# EAGLE board Rev 1 (EAGLE 9.5.2)
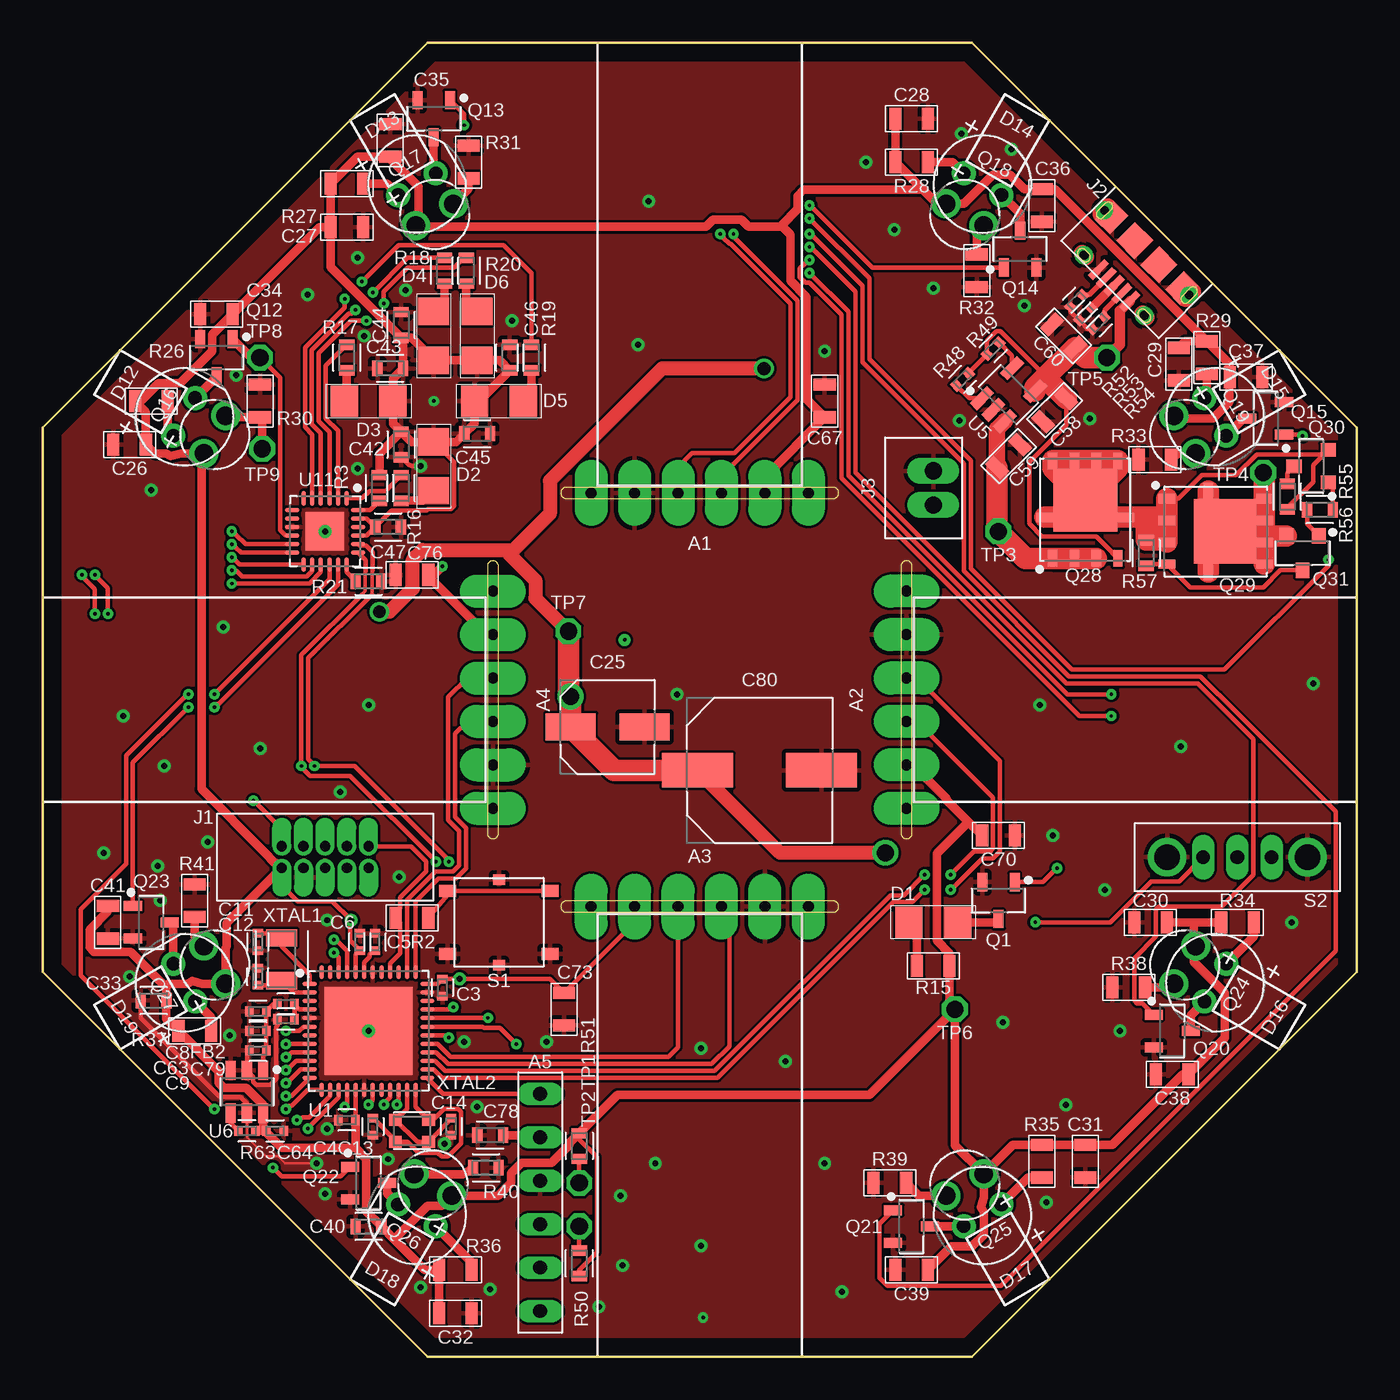
[diagram p8: board, top side]
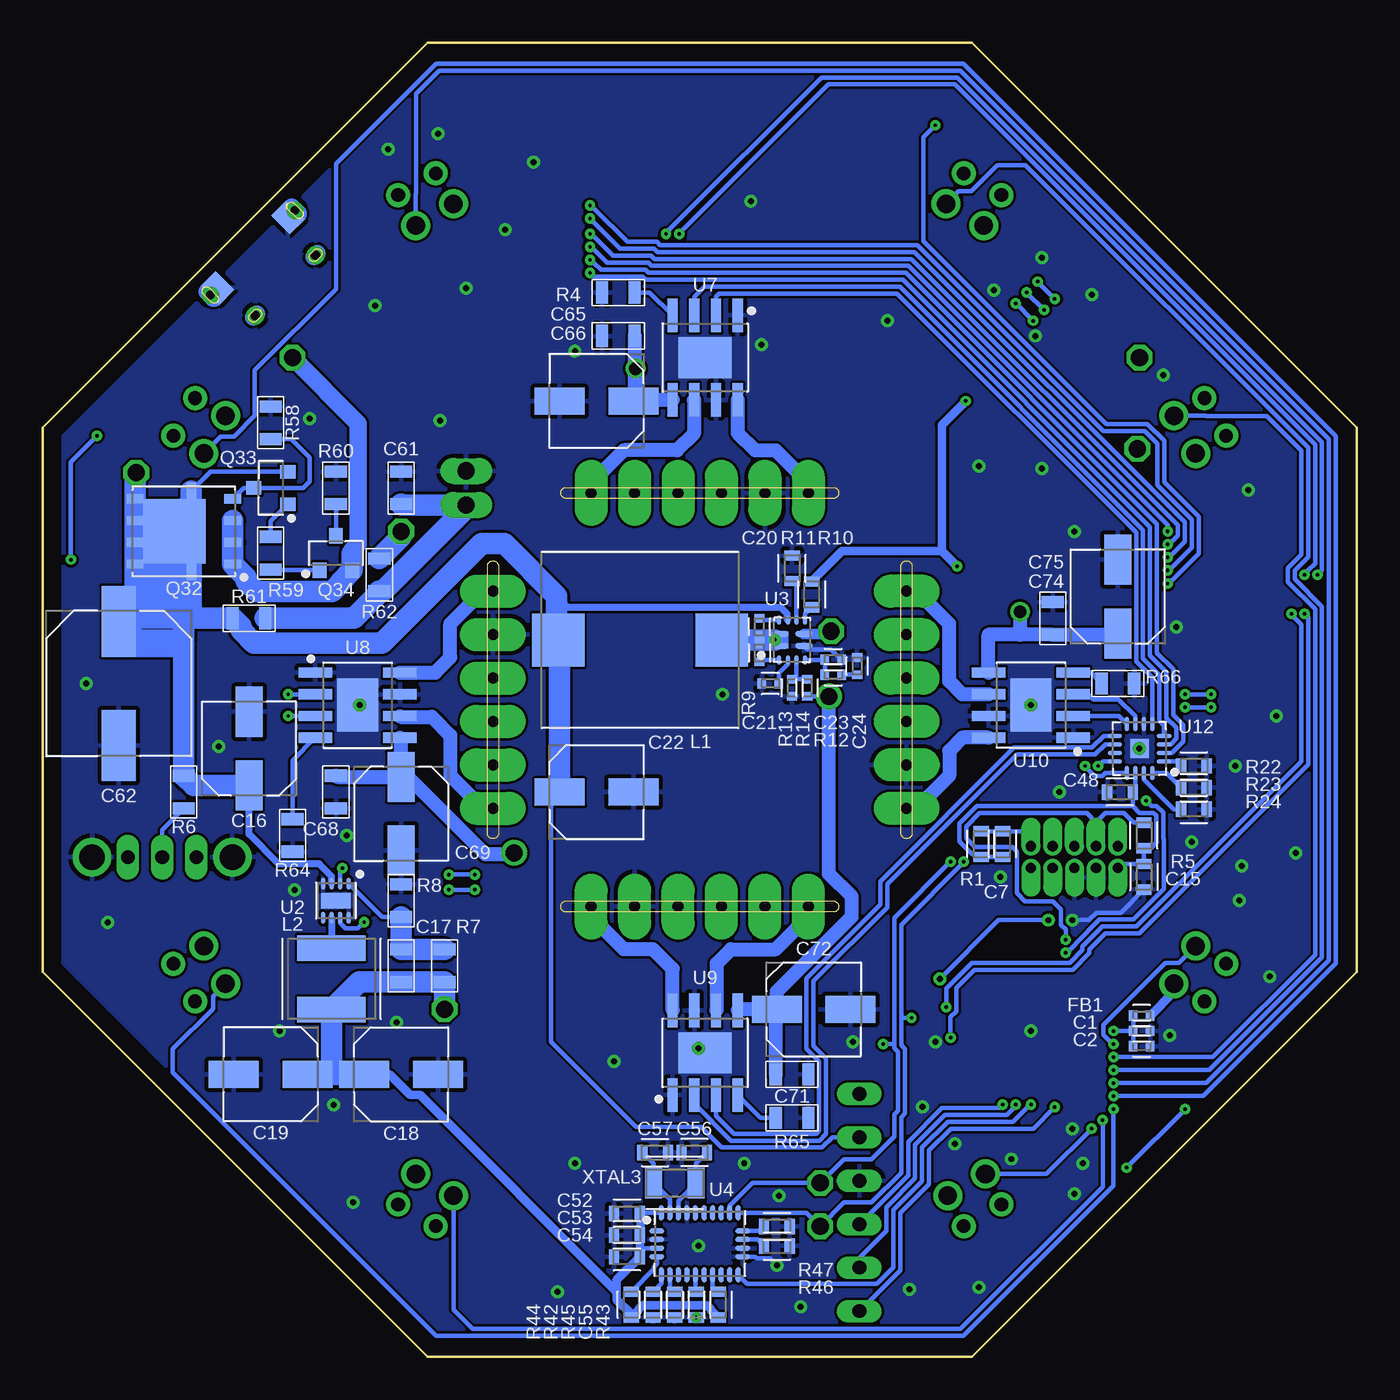
[diagram p9: board, bottom side, seen from below]

Size 76.83 x 76.83 mm. Coordinates in mm from the lower left corner, seen from the top.
Outline: 22.5,0 0,22.5 0,54.33 22.5,76.83 54.33,76.83 76.83,54.33 76.83,22.5 54.33,0 22.5,0
Copper layers (1*16): Top 0.035mm / dielectric 1.5mm / Bottom 0.035mm
Design rules "default *": minimum track width 6mil, minimum drill 0.2mm, track to track 6mil, track to pad 6mil, pad to pad 6mil, via to via 6mil, smd to smd 6mil, copper to edge 40mil, drill to drill 6mil, minimum pad ring 10mil, minimum via ring 8mil, stop-mask expansion 4mil, vias tented up to drill 0mil, thermal gap 10mil

## Footprints (pad centres in the part's own frame; a part is rotated, then mirrored left to right if it is on the bottom)
ENCODER-SLOT = drill 0.65 pad 1.93 long: 1 -6.35,0; 2 -3.81,0; 3 -1.27,0; 4 1.27,0; 5 3.81,0; 6 6.35,0
HC-05 = drill 0.8 long: 1 -6.35,0; 2 -3.81,0; 3 -1.27,0; 4 1.27,0; 5 3.81,0; 6 6.35,0
0402 = smd 0.5 x 0.6: 1 -0.5,0; 2 0.5,0
0603 = smd 0.6 x 0.9: 1 -0.75,0; 2 0.75,0
865080542006 = smd 2.925 x 1.579: + -2.155,0; - 2.155,0
0805 = smd 0.711 x 1.295: P$1 -0.953,0; P$2 0.953,0
EEE-1EA101AP = smd 4.162 x 1.999: + -3.625,0; - 3.625,0
1206 = smd 1.6 x 1.803: 1 -1.422,0; 2 1.422,0
SFH4545 = drill 0.8 pad 1.4: + -1.27,0; - 1.27,0
3220-10-0100-00 = drill 0.6 offset: P1 -0.635,2.54; P2 -0.635,1.27; P3 -0.635,0; P4 -0.635,-1.27; P5 -0.635,-2.54; P6 0.635,-2.54; P7 0.635,-1.27; P8 0.635,0; P9 0.635,1.27; P10 0.635,2.54
10118194-0001LF = smd 0.4 x 1.35: 1 -1.3,4.15; 2 -0.65,4.15; 3 0,4.15; 4 0.65,4.15; 5 1.3,4.15 | drill 0.5 pad 1: 6 -3.5,1.45; 7 3.5,1.45 | smd 1.2 x 1.55: 8 -2.9,1.45; 9 2.9,1.45 | smd 1.2 x 1.55 bottom: 10 -2.9,1.45; 11 2.9,1.45 | drill 0.55 pad 0.95: 12 2.5,4.15; 13 -2.5,4.15 | smd 1.5 x 1.55: 14 -1,1.45; 15 1,1.45
B2B-PH-K-S(LF)(SN) = drill 1 long: 1 -1,0; 2 1,0
104CDMCC = smd 3.062 x 3.11: 1 -4.775,0; 2 4.775,0
NRS5040 = smd 1.5 x 4: 1 -1.8,0; 2 1.8,0
SOT95P230X110-3 = smd 1.059 x 0.59: 1 -1.078,0.95; 2 -1.078,-0.95; 3 1.078,0
TEFT4300 = drill 1.09 pad 1.69: C -1.27,0; E 1.27,0
SI7157DP = smd 0.97 x 0.542: 1 -2.855,1.905; 2 -2.855,0.635; 3 -2.855,-0.635; 4 -2.855,-1.905; 5 2.855,-1.905; 6 2.855,-0.635; 7 2.855,0.635; 8 2.855,1.905 | smd 3.66 x 3.76: 9 0.54,0 | smd 0.542 x 0.97: 10 -0.44,2.365; 11 -0.44,-2.365
SOT96P237X112-3 = smd 0.9 x 0.8: 1 -1,0.95; 2 -1,-0.95; 3 1,0
PTS526SMG15SMTR2LFS = smd 1 x 0.7: 1 -3,1.85; 2 3,1.85; 3 -3,-1.85; 4 3,-1.85 | smd 0.7 x 0.6: 5 0,2.5; 6 0,-2.5
OS102011MS2QN1 = drill 0.8 long: 1 -2,0; 2 0,0; 3 2,0 | drill 1.5: 4 -4.1,0; 5 4.1,0
TESTPOINT = drill 1 octagon: P1 0,0
ATSAMD21G18A-MU = smd 0.837 x 0.264: 1 -3.437,2.75; 2 -3.437,2.25; 3 -3.437,1.75; 4 -3.437,1.25; 5 -3.437,0.75; 6 -3.437,0.25; 7 -3.437,-0.25; 8 -3.437,-0.75; 9 -3.437,-1.25; 10 -3.437,-1.75; 11 -3.437,-2.25; 12 -3.437,-2.75; 25 3.437,-2.75; 26 3.437,-2.25; 27 3.437,-1.75; 28 3.437,-1.25; 29 3.437,-0.75; 30 3.437,-0.25; 31 3.437,0.25; 32 3.437,0.75; 33 3.437,1.25; 34 3.437,1.75; 35 3.437,2.25; 36 3.437,2.75 | smd 0.264 x 0.837: 13 -2.75,-3.437; 14 -2.25,-3.437; 15 -1.75,-3.437; 16 -1.25,-3.437; 17 -0.75,-3.437; 18 -0.25,-3.437; 19 0.25,-3.437; 20 0.75,-3.437; 21 1.25,-3.437; 22 1.75,-3.437; 23 2.25,-3.437; 24 2.75,-3.437; 37 2.75,3.437; 38 2.25,3.437; 39 1.75,3.437; 40 1.25,3.437; 41 0.75,3.437; 42 0.25,3.437; 43 -0.25,3.437; 44 -0.75,3.437; 45 -1.25,3.437; 46 -1.75,3.437; 47 -2.25,3.437; 48 -2.75,3.437 | smd 5.15 x 5.15: 49 0,0
AP3441 = smd 0.715 x 0.27: 1 -1.001,0.75; 2 -1.001,0.25; 3 -1.001,-0.25; 4 -1.001,-0.75; 5 1.001,-0.75; 6 1.001,-0.25; 7 1.001,0.25; 8 1.001,0.75 | smd 0.9 x 1.7: 9 0,0
TPS61089 = smd 0.25 x 0.55: 1 -0.75,-1.175; 2 -0.25,-1.175; 3 0.25,-1.175; 4 0.75,-1.175; 7 0.75,1.175; 8 0.25,1.175; 9 -0.25,1.175; 10 -0.75,1.175 | smd 1 x 0.35: 5 0.7,-0.35; 6 0.7,0.35; 11 -0.7,0.35; 12 -0.7,-0.35 | drill 0.2 pad 0.45: 13 -1,0
BNO055 = smd 0.887 x 0.282: 1 -2.513,0.75; 2 -2.513,0.25; 3 -2.513,-0.25; 4 -2.513,-0.75; 15 2.513,-0.75; 16 2.513,-0.25; 17 2.513,0.25; 18 2.513,0.75 | smd 0.282 x 0.887: 5 -2.25,-1.812; 6 -1.75,-1.812; 7 -1.25,-1.812; 8 -0.75,-1.812; 9 -0.25,-1.812; 10 0.25,-1.812; 11 0.75,-1.812; 12 1.25,-1.812; 13 1.75,-1.812; 14 2.25,-1.812; 19 2.25,1.812; 20 1.75,1.812; 21 1.25,1.812; 22 0.75,1.812; 23 0.25,1.812; 24 -0.25,1.812; 25 -0.75,1.812; 26 -1.25,1.812; 27 -1.75,1.812; 28 -2.25,1.812
MCP73811 = smd 1.412 x 0.59: 1 -1.247,0.95; 2 -1.247,0; 3 -1.247,-0.95; 4 1.247,-0.95; 5 1.247,0.95
MCP1501 = smd 1.119 x 0.59: 1 -1.246,0.95; 2 -1.246,0; 3 -1.246,-0.95; 4 1.246,-0.95; 5 1.246,0; 6 1.246,0.95
DRV8871 = smd 1.968 x 0.599: 1 -2.473,1.905; 2 -2.473,0.635; 3 -2.473,-0.635; 4 -2.473,-1.905; 5 2.473,-1.905; 6 2.473,-0.635; 7 2.473,0.635; 8 2.473,1.905 | smd 2.4 x 3.1: 9 0,0
PCAL6416A = smd 0.86 x 0.264: 1 -1.935,1.25; 2 -1.935,0.75; 3 -1.935,0.25; 4 -1.935,-0.25; 5 -1.935,-0.75; 6 -1.935,-1.25; 13 1.935,-1.25; 14 1.935,-0.75; 15 1.935,-0.25; 16 1.935,0.25; 17 1.935,0.75; 18 1.935,1.25 | smd 0.264 x 0.86: 7 -1.25,-1.935; 8 -0.75,-1.935; 9 -0.25,-1.935; 10 0.25,-1.935; 11 0.75,-1.935; 12 1.25,-1.935; 19 1.25,1.935; 20 0.75,1.935; 21 0.25,1.935; 22 -0.25,1.935; 23 -0.75,1.935; 24 -1.25,1.935 | smd 2.25 x 2.25: 25 0,0
MAX7315 = smd 0.86 x 0.27: 1 -1.435,0.75; 2 -1.435,0.25; 3 -1.435,-0.25; 4 -1.435,-0.75; 9 1.435,-0.75; 10 1.435,-0.25; 11 1.435,0.25; 12 1.435,0.75 | smd 0.27 x 0.86: 5 -0.75,-1.435; 6 -0.25,-1.435; 7 0.25,-1.435; 8 0.75,-1.435; 13 0.75,1.435; 14 0.25,1.435; 15 -0.25,1.435; 16 -0.75,1.435 | smd 1.1 x 1.1: 17 0,0
FC-135 = smd 1 x 1.8: 1 -1.25,0; 2 1.25,0
XRCGB = smd 0.75 x 0.7: 1 0.975,0.65; 2 -0.975,0.65; 3 -0.975,-0.65; 4 0.975,-0.65

## Placement (x,y rotation side)
A1  ENCODERSLOT  [ENCODER-SLOT]  38.41,50.51 180 top
A2  ENCODERSLOT  [ENCODER-SLOT]  50.51,38.41 90 top
A3  ENCODERSLOT  [ENCODER-SLOT]  38.41,26.32 0 top
A4  ENCODERSLOT  [ENCODER-SLOT]  26.32,38.41 270 top
A5  HC-05  [HC-05]  29.08,9.02 90 top
C1  10uF  [0402]  12.57,19.05 180 bottom
C2  0.1uF  [0402]  12.57,18.16 180 bottom
C3  0.1uF  [0402]  23.37,21.59 90 top
C4  0.1uF  [0402]  17.78,13.84 0 top
C5  1uF  [0402]  19.43,24.26 270 top
C6  10uF  [0402]  18.54,24.26 270 top
C7  100pF  [0603]  20.7,29.97 270 bottom
C8  0.1uF  [0402]  12.57,20.19 0 top
C9  4.7uF  [0402]  12.57,17.91 0 top
C11  22pF  [0402]  12.57,24.26 90 top
C12  22pF  [0402]  12.57,22.23 270 top
C13  6.8pF  [0402]  19.3,13.46 90 top
C14  10pF  [0402]  23.88,13.46 90 top
C15  0.1uF  [0603]  12.45,28.07 90 bottom
C16  22uF  [865080542006]  64.77,35.56 90 bottom
C17  22pF  [0805]  55.88,22.86 270 bottom
C18  22uF  [865080542006]  55.88,16.51 0 bottom
C19  22uF  [865080542006]  63.5,16.51 180 bottom
C20  0.1uF  [0402]  34.92,42.67 270 bottom
C21  2.2uF  [0402]  34.29,39.37 0 bottom
C22  22uF  [865080542006]  44.45,33.02 0 bottom
C23  33pF  [0402]  30.61,40.77 180 bottom
C24  680pF  [0402]  29.21,40.39 270 bottom
C25  22uF  [865080542006]  33.02,36.83 0 top
C26  1uF  [0805]  5.08,53.34 0 top
C27  1uF  [0805]  17.78,66.04 180 top
C28  1uF  [0805]  50.8,72.39 180 top
C29  1uF  [0805]  66.42,58.04 90 top
C30  1uF  [0805]  64.77,25.4 0 top
C31  1uF  [0805]  60.96,11.43 90 top
C32  1uF  [0805]  24.13,2.54 180 top
C33  1uF  [0603]  6.48,20.83 0 top
C34  0.1uF  [0805]  10.16,60.96 0 top
C35  0.1uF  [0805]  20.32,71.12 270 top
C36  0.1uF  [0805]  58.42,67.31 90 top
C37  0.1uF  [0805]  70.36,57.28 180 top
C38  0.1uF  [0805]  66.04,16.51 0 top
C39  0.1uF  [0805]  50.8,5.08 0 top
C40  0.1uF  [0603]  19.05,7.62 0 top
C41  0.1uF  [0805]  3.81,25.4 90 top
C42  1uF  [0603]  20.95,53.34 90 top
C43  1uF  [0603]  20.32,57.78 0 top
C44  1uF  [0603]  20.95,60.33 270 top
C45  1uF  [0603]  25.4,53.98 180 top
C46  1uF  [0603]  27.3,58.42 270 top
C47  0.1uF  [0603]  20.19,48.51 180 top
C48  0.1uF  [0603]  13.84,33.02 0 bottom
C52  0.1uF  [0603]  42.67,8.38 0 bottom
C53  0.12uF  [0603]  42.67,7.11 0 bottom
C54  6800pF  [0603]  42.67,5.84 0 bottom
C55  0.1uF  [0603]  38.61,3.05 90 bottom
C56  22pF  [0603]  38.73,11.94 0 bottom
C57  22pF  [0603]  41.02,11.94 180 bottom
C58  1uF  [0805]  59.16,55.35 45 top
C59  1uF  [0805]  56.47,52.66 225 top
C60  1uF  [0805]  59.69,59.69 315 top
C61  10uF  [0805]  55.88,50.8 270 bottom
C62  100uF  [EEE-1EA101AP]  72.39,39.37 270 bottom
C63  300pF  [0402]  12.57,19.05 0 top
C64  2.2uF  [0402]  13.59,13.21 180 top
C65  0.1uF  [0805]  43.18,59.69 0 bottom
C66  22uF  [865080542006]  44.45,55.88 180 bottom
C67  1uF  [0805]  45.72,55.88 270 top
C68  0.1uF  [0805]  59.69,33.02 90 bottom
C69  22uF  [865080542006]  55.88,31.75 270 bottom
C70  1uF  [0805]  55.88,30.48 180 top
C71  0.1uF  [0805]  33.02,16.51 180 bottom
C72  22uF  [865080542006]  31.75,20.32 0 bottom
C73  1uF  [0805]  30.48,20.32 90 top
C74  0.1uF  [0805]  17.78,43.18 270 bottom
C75  22uF  [865080542006]  13.97,44.45 90 bottom
C76  1uF  [0805]  21.59,45.72 0 top
C78  1uF  [0603]  26.16,12.95 0 top
C79  0.1uF  [0402]  14.22,19.74 0 top
C80  100uF  [EEE-1EA101AP]  41.91,34.29 0 top
D1  LED1206  [1206]  52.07,25.4 0 top
D2  LED1206  [1206]  22.86,52.07 270 top
D3  LED1206  [1206]  19.05,55.88 180 top
D4  LED1206  [1206]  22.86,59.69 90 top
D5  LED1206  [1206]  26.67,55.88 0 top
D6  LED1206  [1206]  25.4,59.69 90 top
D12  SFH4545  [SFH4545]  8.27,54.95 60 top
D13  SFH4545  [SFH4545]  21.88,68.56 30 top
D14  SFH4545  [SFH4545]  54.95,68.56 330 top
D15  SFH4545  [SFH4545]  68.56,54.95 300 top
D16  SFH4545  [SFH4545]  68.56,21.88 240 top
D17  SFH4545  [SFH4545]  54.95,8.27 210 top
D18  SFH4545  [SFH4545]  21.88,8.27 150 top
D19  SFH4545  [SFH4545]  8.27,21.88 120 top
FB1  [0402]  12.57,19.94 0 bottom
FB2  [0402]  14.22,20.62 0 top
J1  3220-10-0100-00  [3220-10-0100-00]  16.51,29.21 90 top
J2  10118194-0001LF  [10118194-0001LF]  65.58,65.58 135 top
J3  B2B-PH-K-S(LF)(SN)  [B2B-PH-K-S(LF)(SN)]  52.07,50.8 90 top
L1  10uH  [104CDMCC]  41.91,41.91 180 bottom
L2  3.3uH  [NRS5040]  59.94,22.1 270 bottom
Q1  MMBT3904,215MMBT3904,215  [SOT95P230X110-3]  55.88,26.67 270 top
Q12  MMBT3904,215MMBT3904,215  [SOT95P230X110-3]  10.16,58.42 270 top
Q13  MMBT3904,215MMBT3904,215  [SOT95P230X110-3]  22.86,72.39 270 top
Q14  MMBT3904,215MMBT3904,215  [SOT95P230X110-3]  57.15,64.77 90 top
Q15  MMBT3904,215MMBT3904,215  [SOT95P230X110-3]  71.5,54.86 180 top
Q16  TEFT4300  [TEFT4300]  10.05,53.92 60 top
Q17  TEFT4300  [TEFT4300]  22.91,66.78 30 top
Q18  TEFT4300  [TEFT4300]  53.92,66.78 330 top
Q19  TEFT4300  [TEFT4300]  66.78,53.92 300 top
Q20  MMBT3904,215MMBT3904,215  [SOT95P230X110-3]  66.04,19.05 0 top
Q21  MMBT3904,215MMBT3904,215  [SOT95P230X110-3]  50.8,7.62 0 top
Q22  MMBT3904,215MMBT3904,215  [SOT95P230X110-3]  19.05,10.16 0 top
Q23  MMBT3904,215MMBT3904,215  [SOT95P230X110-3]  6.35,25.4 0 top
Q24  TEFT4300  [TEFT4300]  66.78,22.91 240 top
Q25  TEFT4300  [TEFT4300]  53.92,10.05 210 top
Q26  TEFT4300  [TEFT4300]  22.81,10.05 150 top
Q27  TEFT4300  [TEFT4300]  10.05,22.91 120 top
Q28  SI7157DP  [SI7157DP]  60.96,49.53 90 top
Q29  SI7157DP  [SI7157DP]  68.58,48.26 0 top
Q30  MMBT3906  [SOT96P237X112-3]  74.17,52.07 180 top
Q31  MMBT3906  [SOT96P237X112-3]  73.66,46.99 270 top
Q32  SI7157DP  [SI7157DP]  68.58,48.26 180 bottom
Q33  MMBT3906  [SOT96P237X112-3]  63.5,50.8 180 bottom
Q34  MMBT3906  [SOT96P237X112-3]  59.69,46.99 90 bottom
R1  2.2k  [0603]  21.97,29.97 270 bottom
R2  330R  [0805]  21.59,25.65 180 top
R3  10k  [0603]  19.68,50.8 90 top
R4  30k  [0805]  43.18,62.23 0 bottom
R5  1k  [0603]  12.45,30.48 270 bottom
R6  10k  [0805]  68.58,33.02 90 bottom
R7  68k  [0805]  53.34,22.86 270 bottom
R8  15k  [0805]  55.88,26.67 270 bottom
R9  270k  [0402]  34.92,41.15 90 bottom
R10  10k  [0603]  31.88,44.58 90 bottom
R11  150k  [0603]  33.02,46.1 270 bottom
R12  348k  [0402]  30.61,39.88 180 bottom
R13  18k  [0402]  33.02,39.12 90 bottom
R14  160k  [0402]  32.13,39.12 270 bottom
R15  30R  [0805]  52.07,22.86 0 top
R16  30R  [0603]  20.95,50.8 270 top
R17  30R  [0603]  17.78,58.42 270 top
R18  30R  [0603]  23.5,63.5 270 top
R19  30R  [0603]  28.57,58.42 270 top
R20  30R  [0603]  24.77,63.5 270 top
R21  10k  [0603]  19.05,45.34 180 top
R22  10k  [0603]  9.53,34.54 180 bottom
R23  10k  [0603]  9.53,33.27 180 bottom
R24  10k  [0603]  9.53,32 180 bottom
R26  17R  [0805]  6.35,55.88 0 top
R27  17R  [0805]  17.78,68.58 0 top
R28  17R  [0805]  50.8,69.85 0 top
R29  17R  [0805]  68.07,58.42 270 top
R30  1k  [0805]  12.7,55.88 270 top
R31  1k  [0805]  24.89,69.85 270 top
R32  1k  [0805]  54.61,63.5 90 top
R33  1k  [0805]  65.02,52.45 0 top
R34  17R  [0805]  69.85,25.4 0 top
R35  17R  [0805]  58.42,11.43 270 top
R36  17R  [0805]  24.13,5.08 0 top
R37  17R  [0805]  8.89,19.05 0 top
R38  1k  [0805]  63.5,21.59 0 top
R39  1k  [0805]  49.53,10.16 0 top
R40  1k  [0603]  25.91,11.05 180 top
R41  1k  [0805]  8.89,26.67 270 top
R42  10k  [0603]  41.15,3.05 90 bottom
R43  10k  [0603]  37.34,3.05 270 bottom
R44  10k  [0603]  42.42,3.05 270 bottom
R45  10k  [0603]  39.88,3.05 90 bottom
R46  10k  [0603]  33.91,6.48 180 bottom
R47  10k  [0603]  33.91,7.62 180 bottom
R48  10k  [0402]  53.78,57.15 45 top
R49  10k  [0402]  55.57,58.95 225 top
R50  4.7k  [0603]  31.37,5.46 270 top
R51  4.7k  [0603]  31.37,12.32 90 top
R52  10k  [0402]  60.45,61.72 45 top
R53  100k  [0402]  60.96,60.96 45 top
R54  100k  [0402]  61.72,60.45 45 top
R55  68k  [0603]  72.77,50.29 270 top
R56  10k  [0603]  74.68,49.53 0 top
R57  100k  [0603]  64.52,46.99 90 top
R58  100k  [0805]  63.5,54.61 270 bottom
R59  10k  [0805]  63.5,46.99 90 bottom
R60  68k  [0805]  59.69,50.8 270 bottom
R61  0R  [0805]  64.77,43.18 0 bottom
R62  0R  [0805]  57.15,45.72 270 bottom
R63  10k  [0402]  11.94,13.21 0 top
R64  30k  [0805]  62.23,30.48 90 bottom
R65  30k  [0805]  33.02,13.97 180 bottom
R66  30k  [0805]  13.97,39.37 180 bottom
S1  PTS526SMG15SMTR2LFS  [PTS526SMG15SMTR2LFS]  26.67,25.4 180 top
S2  OS102011MS2QN1  [OS102011MS2QN1]  69.85,29.21 180 top
TP1  TESTPOINT  [TESTPOINT]  31.37,10.16 270 top
TP2  TESTPOINT  [TESTPOINT]  31.37,7.62 270 top
TP3  TESTPOINT  [TESTPOINT]  55.88,48.26 0 top
TP4  TESTPOINT  [TESTPOINT]  71.37,51.69 0 top
TP5  TESTPOINT  [TESTPOINT]  62.23,58.42 0 top
TP6  TESTPOINT  [TESTPOINT]  53.34,20.32 0 top
TP7  TESTPOINT  [TESTPOINT]  30.73,42.42 0 top
TP8  TESTPOINT  [TESTPOINT]  12.7,58.42 0 top
TP9  TESTPOINT  [TESTPOINT]  12.83,53.09 0 top
U1  ATSAMD21G18A-MU  [ATSAMD21G18A-MU]  19.05,19.05 0 top
U2  AP3441  [AP3441]  59.69,26.67 270 bottom
U3  TPS61089  [TPS61089]  33.02,41.91 0 bottom
U4  BNO055  [BNO055]  38.41,6.6 0 bottom
U5  MCP73811  [MCP73811]  56.47,56.25 45 top
U6  [MCP1501]  11.94,15.49 270 top
U7  DRV8871  [DRV8871]  38.1,58.42 270 bottom
U8  DRV8871  [DRV8871]  58.42,38.1 0 bottom
U9  DRV8871  [DRV8871]  38.1,17.78 90 bottom
U10  DRV8871  [DRV8871]  19.05,38.1 180 bottom
U11  PCAL6416A  [PCAL6416A]  16.51,48.26 270 top
U12  MAX7315  [MAX7315]  12.7,35.56 180 bottom
XTAL1  32.768kHz  [FC-135]  13.97,23.24 270 top
XTAL2  32MHz  [XRCGB]  21.59,13.21 0 top
XTAL3  32.768kHz  [FC-135]  39.88,10.16 180 bottom

## Tracks (layer width: path | path; a pad name or v marks a point on that pad's centre or on a via)
!RESET
  Top 0.254: U1.40 20.3,22.99 20.89,23.58 20.89,25.4 R2.P$2 20.64,25.97 20.89,26.23 20.89,26.87 22.4,28.38 22.4,28.96 21.52,29.84 J1.P6
  Bottom 0.254: R1.1 C7.1 19.19,30.72 19.18,30.73 19.05,30.61 J1.P6
+3V3  (via drill 0.2, 0.35)
  Top 0.254: U1.36 23.08,21.8 C3.2 v24.38,22.1 29.65,22.1 C73.P$2 34.6,25.4 A3.2 | 12.89,13.97 12.89,13.41 C64.2 | R51.2 31.37,12.71 32.4,11.68 32.4,6.1 31.37,5.07 R50.2 | C4.2 18.28,15.59 U1.17 | U1.44 18.3,23.52 C6.2 17.96,24.34 17.96,25.46 v18.03,25.53 16.93,26.63 14.89,26.63 13.97,27.56 J1.P1 | U11.23 18.95,49.01 C47.2 | U11.21 18.94,48.01 C47.2 | C47.2 20.4,49.47 22.44,49.47 22.54,49.57 23.88,49.57 24.04,49.73 24.04,52.31 D2.1
  Top 0.508: A4.2 25.95,42.23 22.54,45.64 C76.P$2 22.86,45.72 v23.37,46.23 | A1.2 42.23,51.43 C67.P$2 44.67,55.98 44.67,61.96 43.72,62.91 43.72,65.61 43.25,66.07 | C70.P$2 54.13,31.27 | 54.13,31.27 52.85,32.56 52.85,32.63 50.88,34.6 A2.2 | TP6.P1 53.02,20.64 R15.P$2 53.02,23.59 52.29,24.33 52.29,29.43 54.13,31.27 | Q25.C 56.72,12.38 R35.P$1 C31.P$2 62.54,12.38 66.67,16.51 C38.P$2 69.11,18.63 69.11,21.27 67.31,23.07 67.31,24.11 | Q25.C 55.02,9.34 54.86,8.75 55.02,8.48 55.02,7.96 55.04,7.95 55.04,7.14 54.34,6.45 53.12,6.45 C39.P$2 | R34.P$1 67.31,25.4 | 67.31,25.4 C30.P$2 | Q24.C 67.31,24.11 | 67.31,24.11 67.31,25.4 | C29.P$2 66.8,59.37 R29.P$1 | R29.P$1 69.41,58.04 C37.P$2 69.38,57.25 69.38,55.83 68.42,54.86 66.3,54.86 Q19.C | 51.47,68.23 52.28,67.42 Q18.C 53.86,67.42 55.56,69.11 56.54,69.11 57.39,68.26 C36.P$2 59.18,68.26 66.31,61.12 66.32,61.12 R29.P$1 | 51.47,68.23 R28.P$1 C28.P$2 | C27.P$2 R27.P$1 18.41,70.17 C35.P$2 20.32,70.06 21.97,68.42 21.97,66.3 Q17.C 21.88,66.07 38.78,66.07 39.2,66.5 40.85,66.5 41.27,66.07 43.25,66.07 | C27.P$2 16.19,66.04 C34.P$2 9.91,59.76 9.91,58.8 8.04,56.93 6.78,56.93 5.72,55.88 R26.P$1 6.03,55.24 C26.P$2 6.55,52.82 7.21,52.82 7.48,52.66 8.07,52.82 Q16.C 9.29,52.69 9.29,33.19 13.01,29.46 13.01,29.45 13.57,28.89 13.66,28.89 J1.P1 10.76,25.36 10.76,23.99 10.69,23.91 Q27.C 9.34,21.81 8.75,21.97 8.48,21.81 8.45,21.79 7.31,21.79 7.23,21.71 7.23,21.59 | 7.23,21.59 C33.2 7.23,19.76 R37.P$1 10.29,16.7 10.29,16.01 10.58,15.72 11.89,15.72 12.89,14.73 U6.6 12.89,13.97 12.89,13.4 12.7,13.21 | C32.P$2 R36.P$1 22.34,5.08 20.7,6.72 20.54,6.88
  Top 0.508: 20.54,6.88 C40.2 18.91,8.51 18.91,11.57 18.28,12.2 | 20.54,6.88 22.49,8.82 23.32,8.82 Q26.C 26.62,9.41 27.37,10.16 27.37,10.73 27.99,11.35 29.76,11.35 30.8,12.39 30.8,12.5 R51.2 33.6,15.3 48.32,15.3 TP6.P1 | Q25.C 53.34,12.37 TP6.P1 | 18.28,12.2 C4.2 | 18.28,12.2 13.97,12.2 13.09,13.08 C64.2 12.7,13.21 | 12.7,13.21 R63.2 | C42.2 21.55,53.49 D2.1 24.17,53.49 C45.2 25.25,54.57 D5.1 25.52,55.88 C46.2 26.71,58.27 D6.1 D4.1 21.55,59.58 C44.2 | C42.2 20.47,54.57 D3.1 20.47,57.19 C43.2 21.07,59.46 C44.2 | C44.2 16.83,63.7 C27.P$2 | C41.P$2 3.81,26.03 2.76,24.97 2.76,23.92 2.99,23.69 5.13,23.69 7.23,21.59 | 51.47,68.23 44.48,68.23 44.12,67.87 44.12,67.09 43.18,66.14 43.25,66.07 | R3.2 19.68,52.82 C42.2
  Bottom 0.254: J1.P1 13.73,28.82 C15.2 R5.2 12.05,29.73 11.68,30.1 11.72,30.13 11.72,31.65 11.88,31.81 12.7,31.81 13.08,32.19 | U4.28 41.89,8.42 | U4.3 41.92,6.35 | 13.08,32.19 22.22,32.19 23.23,31.18 23.23,30.14 22.49,29.39 22.14,29.39 R1.2 C7.2 | U12.14 12.95,33.16 C48.2 13.09,32.2 13.08,32.19 | v18.03,25.53 20.95,25.53 v24.38,22.1
  Bottom 0.508: C52.2 41.89,8.42 41.89,7.15 C53.2 41.92,6.35 C54.2 43.27,4.49 43.27,3.81 | 43.27,3.81 43.27,3.33 42.42,2.47 R44.2 42,2.71 42,2.77 41.77,3 37.99,3 37.75,2.77 37.75,2.71 R43.2 | 43.27,3.81 54.78,15.31 55.36,15.31 56.55,16.51 C18.+ | FB1.2 10.69,21.33 Q27.C | v23.37,46.23 24.26,47.12 | R10.2 30.09,47.12 24.26,47.12 | v22.86,55.88 24.26,54.48 24.26,47.12
  Bottom 1.27: C18.+ 59.69,16.51 | 59.69,16.51 C19.+ | 59.69,16.51 59.94,16.76 L2.2 58.33,21.91 C17.P$2 R7.P$2 TP6.P1
  pour Top: 20.95,59.69 20.95,57.78 20.32,57.15 20.32,54.61 21.59,53.34 24.13,53.34 25.4,54.61 25.4,55.88 27.3,57.78 26.67,58.42 22.86,58.42 21.59,59.69
+3V7
  Top 0.508: C78.2 28.96,12.95 A5.5
  Top 1.27: Q32.8 Q32.7 Q32.6 | Q32.6 Q32.5 71.44,51.63 TP4.P1 | Q32.6 70.8,48.26 Q32.9 | Q32.11 68.14,48.26 | 68.14,48.26 Q32.10 | Q32.9 68.14,48.26 | Q31.2 69.39,47.99 Q32.9
  Bottom 0.254: Q33.2 67.02,51.75 Q32.11 | A5.5 30.66,12.83 31.26,12.23 37.13,12.23 38.33,13.43 42.13,13.43 47.12,18.41 47.12,32.51 C22.+
  Bottom 0.406: U2.3 59.95,27.68 59.95,28.1 60.67,28.82 63.02,28.82 64.77,30.56 C16.+ | U3.9 33.29,43.1 33.29,43.43 33.68,43.82 46.12,43.82 46.78,44.48
  Bottom 1.27: Q32.7 Q32.6 | Q32.6 Q32.5 71.44,51.63 TP4.P1 | Q32.11 68.14,49.97 69.85,48.26 | Q32.9 68.14,47.28 Q32.10 68.14,43.24 68.2,43.18 | Q32.9 69.85,48.26 | Q32.8 Q32.7 | Q32.8 Q32.6 | Q32.7 70.8,48.26 | Q32.6 70.8,48.26 | 70.8,48.26 69.85,48.26 | Q32.8 71.44,43.31 71.31,43.18 | 72.58,43.18 C62.+ 71.31,41.91 68.58,41.91 | 68.2,43.18 R61.P$1 65.24,42.7 65.24,42.49 64.5,41.74 56.97,41.74 51.19,47.53 49.84,47.53 46.78,44.48 46.78,42 L1.2 46.6,41.83 C22.+ | 68.2,43.18 68.96,43.18 | 68.96,43.18 70.23,43.18 | 70.23,43.18 71.31,43.18 | 71.31,43.18 72.58,43.18 | Q32.9 69.12,43.34 68.96,43.18 | Q32.9 70.23,47.15 70.23,43.18 | 68.58,41.91 R6.P$2 68.01,33.41 C16.+ | 68.58,41.91 68.58,42.8 68.96,43.18 | 68.58,41.91 68.96,41.53 72.01,41.53 72.58,42.09 72.58,43.18
+5V
  Top 0.254: R48.2 R49.2 55.22,59.41 55.77,59.97 56.01,59.97 58.46,57.52 58.46,57.11 | Q28.4 62.51,47.03 62.51,47.05 61.6,47.96 58.43,47.96 57.68,48.71 57.68,52.3 59.84,54.46 C58.P$2
  Top 0.584: J2.1 62.99,61.15
  Top 0.61: TP5.P1 62.99,59.18 62.99,61.15
  Top 1.27: TP5.P1 60.96,58.42 C60.P$2 58.46,57.11 | 58.46,57.11 58.02,56.68 U5.4 | C58.P$2 58.75,57.11 58.46,57.11
  Bottom 1.016: 58.74,46.98 58.74,47.16 58.38,47.51 58.38,54.57 TP5.P1
  Bottom 1.27: Q32.3 Q32.2 Q32.1 64.94,45.56 64.94,45.36 64.33,44.75 59.91,44.75 59.45,45.21 59.45,45.28 Q34.2 58.74,46.98
+12V  (via drill 0.75, 1)
  Top 0.813: TP7.P1 28.81,44.34 28.81,45.4 27.28,46.93 27.53,47.18 | v19.68,43.56 20.27,43.56 21.63,44.92 21.63,46.6 22.21,47.18 27.53,47.18 | 27.53,47.18 29.65,49.3 29.65,51.22 36.22,57.78 v42.16,57.78 | v49.28,29.46 43.11,29.46 C80.+
  Top 1.27: TP7.P1 30.73,38.73 v30.86,38.61 v30.86,38.6 C25.+ 33.41,34.29 C80.+
  Bottom 0.254: R14.2 32.12,38.61 v30.86,38.61
  Bottom 0.61: U3.6 30.89,42.26 TP7.P1
  Bottom 0.813: U10.5 21.52,42.23 19.68,42.23 | 19.68,42.23 C74.P$2 14.04,42.23 C75.+ | U7.5 42.23,55.95 | C65.P$2 42.23,55.95 | 42.23,55.95 | 42.23,55.95 42.16,56.01 v42.16,57.78 | C69.+ 55.88,36.13 U8.5 | C68.P$2 59.62,33.91 C69.+ | C72.+ 36.13,20.32 U9.5 | C71.P$2 33.97,20.25 C72.+ | C66.+ 42.23,55.95 | v19.68,43.56 19.68,42.23 | C72.+ 33.91,21.36 29.52,25.74 29.52,26.9 30.86,28.24 v30.86,38.61 | C69.+ 55.47,33.91 50.96,29.4 49.34,29.4 v49.28,29.46
BT_EN
  Top 0.254: A5.6 23.42,15.37 U1.25
BT_RX  (via drill 0.2)
  Top 0.254: U1.22 20.8,14.83 v20.7,14.73
  Bottom 0.254: A5.3 26.23,10.59 26.23,12.57 24.24,14.56 20.88,14.56 v20.7,14.73
BT_STATE  (via drill 0.2)
  Top 0.254: U1.16 17.8,14.75 v17.65,14.61
  Bottom 0.254: v17.65,14.61 18.92,13.34 23.74,13.34 25.01,12.06 25.01,10.09 26.68,8.41 26.68,5.06 A5.1
BT_TX  (via drill 0.2)
  Top 0.254: U1.21 20.3,15.15 20.12,14.97 20.12,14.91 v19.94,14.73
  Bottom 0.254: v19.94,14.73 20.12,14.55 20.12,14.49 20.46,14.15 24.07,14.15 25.82,12.4 25.82,10.43 27.5,8.75 27.5,7.36 29.08,5.77 A5.2
ENCODER_1A  (via drill 0.2)
  Top 0.254: A1.3 39.69,51.5 44.13,55.94 44.13,61.74 40.39,65.48 v40.39,65.66 | v2.29,45.72 2.46,45.54 2.46,45.48 3.05,44.9 v3.05,43.43 | v23.75,18.67 23.62,18.8 U1.30
  Bottom 0.254: v40.39,65.66 40.21,65.84 40.21,65.9 31.31,74.8 23.34,74.8 2.03,53.49 2.03,45.97 v2.29,45.72 | v3.05,43.43 2.85,43.23 2.85,34.62 12.72,24.74 14.71,24.74 15.62,23.83 15.62,23.62 16.61,22.63 22.34,22.63 23.42,21.56 23.42,20.21 23.75,19.88 v23.75,18.67
ENCODER_1B  (via drill 0.2)
  Top 0.254: A1.4 37.15,52 37.97,52.83 40.45,52.83 43.73,56.11 43.73,61.57 40.22,65.08 40.15,65.08 39.8,65.42 39.8,65.48 v39.62,65.66 | v3.05,45.72 3.81,44.96 v3.81,43.43 | v24,20.45 23.86,20.3 U1.33
  Bottom 0.254: v39.62,65.66 30.89,74.39 23.51,74.39 2.44,53.32 2.44,46.39 2.87,45.96 2.87,45.9 v3.05,45.72 | v3.81,43.43 3.63,43.26 3.63,43.19 3.25,42.81 3.25,34.79 12.89,25.15 14.88,25.15 16.03,24 16.03,23.79 16.78,23.04 22.51,23.04 24,21.55 v24,20.45
ENCODER_2A  (via drill 0.2)
  Top 0.254: v53.09,28.19 54.45,29.55 55.4,29.55 55.56,29.72 55.56,32.7 51.05,37.21 50.58,37.21 A2.3 | v51.56,28.19 50.35,26.99 49.56,26.99 39.28,16.71 23.52,16.71 22.93,17.3 U1.27
  Bottom 0.254: v51.56,28.19 v53.09,28.19
ENCODER_2B  (via drill 0.2)
  Top 0.254: v53.09,27.3 54.93,29.15 55.57,29.15 55.97,29.55 55.97,34.84 51.12,39.69 A2.4 | v51.56,27.3 50.84,26.58 49.73,26.58 39.45,16.3 23.36,16.3 22.86,16.8 U1.26
  Bottom 0.254: v53.09,27.3 v51.56,27.3
ENCODER_3A
  Top 0.254: A3.3 37.15,18.09 36.58,17.52 23.86,17.52 23.08,18.3 U1.29
ENCODER_3B
  Top 0.254: A3.4 40.15,25.86 40.15,18.15 39.12,17.11 23.69,17.11 23,17.8 U1.28
ENCODER_4A
  Top 0.254: A4.3 24.83,39.69 23.7,38.56 23.7,31.38 24.33,30.75 24.33,28.71 23.99,28.37 22.97,28.37 21.3,26.7 U1.38
ENCODER_4B
  Top 0.254: A4.4 24.83,37.15 24.11,36.43 24.11,31.55 24.74,30.92 24.74,28.55 24.16,27.97 23.14,27.97 21.8,26.62 U1.37
GND  (via drill 0.2, 0.35)
  Top 0.152: v16,11.3 14.19,11.3 13.77,11.72 13.05,11.72 11.96,12.82 11.96,14.23 U6.5
  Top 0.254: R54.1 61.11,60.1 R53.1 60.1,61.11 R52.1 | C9.1 11.94,17.77 U6.2 12.31,16.36 12.31,16.07 12.48,15.9 13.3,15.9 13.64,16.24 13.64,19.29 13.72,19.37 C79.1 | U6.5 11.94,14.8 11.55,15.19 10.36,15.19 5.73,19.82 C33.1 | C42.1 21.42,52.13 21.52,52.13 21.58,52.07 v22.1,52.07 | v23.5,12.45 23.5,12.58 C14.1
  Bottom 0.254: C23.1 30.16,40.77 30.74,41.35 32.11,41.35 U3.5 | v33.91,5.33 34.32,5.75 35.08,5.75 35.18,5.85 U4.15 | C15.1 13.8,25.96 15.22,25.96 15.65,25.53 v16.64,25.53
  other vias: 16.51,48.26 5.08,22.23 6.86,26.67 16.64,13.34 20.19,11.56 16.51,9.53 26.16,3.94 22.1,4.06 19.05,19.05 24.64,18.41 43.43,17.27 35.81,11.3 33.78,9.4 32.51,2.92 38.48,6.48 45.72,11.3 46.74,3.81 58.67,9.02 59.82,14.73 62.99,19.05 56.13,19.56 73.03,25.4 62.1,27.3 59.05,30.48 66.55,35.69 58.29,38.1 74.3,39.37 61.21,54.86 57.4,61.47 53.59,54.74 52.07,62.48 49.78,65.91 56.64,70.61 53.72,71.5 48.13,69.85 35.43,67.56 34.8,59.18 15.49,62.1 18.41,64.26 18.8,59.69 6.35,50.67 4.7,37.47 3.56,29.46 6.73,28.7 9.65,30.1 7.11,34.54 10.54,42.67 17.4,33.02 19.05,38.1 38.48,18.03 10.92,18.8 18.41,51.94 29.46,18.41 45.72,58.8 27.43,60.58 21.21,62.36 37.08,38.73 12.7,35.56 38.61,2.29 11.3,57.4 25.4,14.61 20.83,28.07
  pour Top (rank 2): 0,0 0,77.47 26.67,76.83 77.47,76.83 76.83,43.18 76.83,0
  pour Bottom: 0,0 0,77.47 30.48,76.83 77.47,76.83 76.83,29.21 76.83,0
IMU_INT  (via drill 0.2)
  Top 0.254: U1.19 19.3,14.98 v19.05,14.73
  Bottom 0.254: v19.05,14.73 19.11,14.73 20.1,13.74 23.91,13.74 25.41,12.23 25.41,10.26 27.09,8.58 27.09,5.23 28.04,4.27 35.65,4.27 U4.14
IR1
  Top 0.254: U11.10 14.2,48.01 13.87,48.34 13.87,57.25 TP8.P1
  Top 0.508: TP8.P1 12.19,58.42 Q12.1
IR2  (via drill 0.2)
  Top 0.254: Q13.1 24.64,72.64 v24.64,72.01 | v11.05,45.21 11.48,45.21 11.49,45.21 15.6,45.21 16.26,45.87 U11.15
  Bottom 0.254: v24.64,72.01 25.34,71.31 25.34,65.22 14.65,54.53 12.23,54.53 11.26,53.55 11.26,51.14 9.25,49.13 9.25,46.95 10.81,45.39 10.87,45.39 v11.05,45.21
IR3  (via drill 0.2)
  Top 0.254: v44.83,67.31 45.01,67.13 45.07,67.13 48.51,63.69 Q14.1 | v11.05,45.97 11.3,45.97 11.66,45.62 15.43,45.62 15.76,45.95 U11.14
  Bottom 0.254: v44.83,67.31 44.65,67.13 44.59,67.13 42.65,65.19 40.91,65.19 40.73,65 25.7,65 14.81,54.12 12.4,54.12 11.67,53.39 11.67,50.97 9.65,48.96 9.65,47.31 10.81,46.15 10.87,46.15 v11.05,45.97
IR4  (via drill 0.2)
  Top 0.254: Q15.1 73.59,53.91 v73.66,53.85 | v75.18,46.61 75.18,46.27 69.1,40.18 60.18,40.18 54.26,46.1 54.26,52.4 48.33,58.33 48.33,63.05 v44.83,66.55 | v11.05,46.74 11.23,46.56 11.29,46.56 11.52,46.33 U11.13
  Bottom 0.254: v73.66,53.85 75.18,52.32 v75.18,46.61 | v44.83,66.55 43.07,64.78 41.08,64.78 40.9,64.59 25.86,64.59 10.06,48.79 10.06,47.66 10.81,46.91 10.87,46.91 v11.05,46.74
IR5  (via drill 0.2)
  Top 0.254: Q20.1 64.3,20.66 63.98,20.66 63.82,20.83 63.82,23.3 65.09,24.57 65.09,26.16 65.25,26.33 68.94,26.33 70.78,28.17 70.78,36.11 67.53,39.37 59.84,39.37 47.51,51.7 47.51,62.28 45.07,64.72 45.01,64.72 v44.83,64.9 | v11.05,48.26 11.23,48.08 11.29,48.08 11.86,47.51 U11.11
  Bottom 0.254: v44.83,64.9 44.65,64.72 44.59,64.72 43.84,63.97 41.42,63.97 41.23,63.78 26.2,63.78 11.05,48.63 v11.05,48.26
IR6  (via drill 0.2)
  Top 0.254: Q21.1 48.91,7.76 48.91,4.62 49.38,4.15 56.03,4.15 75.61,23.73 75.61,31.88 68.75,38.73 68.74,38.73 67.69,39.78 60.01,39.78 53.86,45.93 53.86,52.23 47.92,58.16 47.92,62.63 45.07,65.48 45.01,65.48 v44.83,65.66 | v11.05,47.5 11.23,47.32 11.29,47.32 11.6,47.01 U11.12
  Bottom 0.254: v44.83,65.66 44.65,65.48 44.59,65.48 43.49,64.38 41.25,64.38 41.06,64.19 26.03,64.19 10.47,48.62 10.47,48.02 10.99,47.5 v11.05,47.5
IR7  (via drill 0.2)
  Top 0.254: v10.03,38.73 16.76,45.46 U11.16 | Q22.1 17.4,10.54 13.97,10.54 v13.46,11.05 | v10.03,14.48 2.22,22.29 2.22,26.16 4.87,28.81 4.87,35.15 8.27,38.56 8.33,38.56 v8.51,38.73
  Bottom 0.254: v8.51,38.73 v10.03,38.73 | v13.46,11.05 v10.03,14.48
IR8  (via drill 0.2)
  Top 0.254: Q23.1 5.27,34.74 v8.51,37.97 | v10.03,37.97 10.21,38.15 10.27,38.15 17.26,45.14 U11.17
  Bottom 0.254: v8.51,37.97 v10.03,37.97
LED0
  Top 0.254: R16.1 20.03,50.63 19.12,50.63 18.68,50.2 U11.1
LED1
  Top 0.254: U11.2 17.26,54.15 16.55,54.86 16.55,57.94 R17.1
LED2  (via drill 0.2)
  Top 0.254: U11.4 16.26,54 15.74,54.53 15.74,58.85 17.88,60.98 18.06,60.98 v18.29,61.21 | v19.3,62.23 21.32,64.25 R18.1
  Bottom 0.254: v18.29,61.21 v19.3,62.23
LED3  (via drill 0.2)
  Top 0.254: U11.5 15.76,53.93 15.33,54.36 15.33,59.01 17.65,61.34 v17.65,61.85 | v18.67,62.87 20.8,64.99 26.96,64.99 28.57,63.37 R19.1
  Bottom 0.254: v17.65,61.85 v18.67,62.87
LED4  (via drill 0.2)
  Top 0.254: R20.1 24.64,64.25 24.06,63.67 21.32,63.67 19.94,62.29 v19.94,61.59 | U11.3 16.76,54.08 16.14,54.69 16.14,58.68 18.04,60.58 v18.92,60.58
  Bottom 0.254: v18.92,60.58 v19.94,61.59
MOTOR_1A
  Bottom 0.254: U12.4 11.27,36.92 11.54,37.19 11.54,39.5 11.54,39.51 11.54,39.87 12.49,40.82 12.49,48.35 26.71,62.56 38.15,62.56 38.73,61.98 U7.3
MOTOR_1B
  Bottom 0.254: U7.2 37.47,61.98 37.28,62.16 26.88,62.16 12.9,48.18 12.9,40.65 11.95,39.7 U12.5
MOTOR_2A  (via drill 0.2)
  Top 0.254: v44.83,64.14 44.65,63.96 44.59,63.96 44.25,63.61 44.25,63.13 44.59,62.79 44.84,62.79 46.7,60.93 46.7,51.36 60.6,37.47 v62.48,37.47
  Bottom 0.254: U12.2 10.81,35.31 10.15,35.97 10.15,36.95 10.72,37.53 10.72,40.2 11.68,41.16 11.68,48.69 26.37,63.38 41.4,63.38 41.59,63.56 44.2,63.56 44.59,63.96 44.65,63.96 v44.83,64.14 | U8.3 v62.48,37.47
MOTOR_2B  (via drill 0.2)
  Top 0.254: v44.83,63.37 47.11,61.1 47.11,51.53 59.9,38.73 v62.48,38.73
  Bottom 0.254: U12.3 10.88,35.81 10.56,36.14 10.56,36.78 11.13,37.36 11.13,40.03 12.09,40.99 12.09,48.52 26.54,62.97 41.57,62.97 41.76,63.16 44.62,63.16 v44.83,63.37 | U8.2 v62.48,38.73
MOTOR_3A
  Bottom 0.254: U12.9 14.78,36.31 15.48,35.62 20.04,35.62 27.85,27.81 27.85,26.44 32.16,22.13 32.16,18 31.43,17.27 31.43,13.21 31.6,13.04 36.41,13.04 37.47,14.1 U9.3
MOTOR_3B
  Bottom 0.254: U12.10 14.71,35.81 15.31,35.21 19.88,35.21 27.45,27.64 27.45,26.27 31.76,21.96 31.76,18.17 31.03,17.44 31.03,13.04 31.43,12.64 36.58,12.64 38.73,14.79 U9.2
MOTOR_4A
  Bottom 0.254: U12.7 12.95,37.46 13.93,38.44 15.39,38.44 15.69,38.73 U10.3
MOTOR_4B
  Bottom 0.254: U12.8 13.92,37.47 U10.2
N$1
  Top 0.254: S1.3 S1.4 23.67,27.01 R2.P$1
N$2
  Top 0.254: C5.2 19.36,23.76 19.12,23.52 19.12,23.39 18.8,23.07 U1.43
N$3
  Bottom 0.406: U2.6 L2.1
  Bottom 0.508: L2.1
N$4  (via drill 0.2)
  Top 0.254: v14.22,19.05 14.99,19.05 15.24,19.3 U1.6
  Bottom 0.254: C2.2 C1.2 | C1.2 FB1.1 | C1.2 v14.22,19.05
N$5
  Bottom 0.254: U2.1 56.99,25.72 R8.P$2
  Bottom 1.27: R7.P$1 C17.P$1 R8.P$2
N$6  (via drill 0.2)
  Top 0.254: v58.04,25.4 62.42,25.4 64.83,27.81 66.45,27.81 S2.3
  Bottom 0.254: v58.04,25.4 58.41,25.03 59.11,25.03 59.44,25.36 U2.7
N$7
  Bottom 0.254: S2.2 69.85,30.8 R6.P$1
N$8
  Bottom 0.254: U3.10 34.84,43.09 C20.1
N$9
  Bottom 0.254: U3.1 34.84,40.73 R9.1
N$10
  Bottom 0.254: U3.12 33.72,41.61 U3.13 34.02,41.96 U3.11 | R9.2 34.66,41.91 34.12,41.91 34.38,42.17 C20.2
  Bottom 1.27: U3.13 34.12,41.91 L1.1
N$11
  Bottom 0.254: U3.8 32.77,45.1 R11.2
N$12
  Bottom 0.254: C21.2 33.79,39.99 33.27,40.51 U3.2
N$13
  Bottom 0.254: U3.4 31.14,40.73 C23.2 R12.2
N$14
  Bottom 0.254: U3.7 32.27,43.43 R10.1
N$15
  Bottom 0.254: R12.1 29.22,39.88 C24.2
N$16  (via drill 0.2)
  Top 0.254: Q1.1 58.48,27.75 v59.31,28.57
  Bottom 0.254: U2.2 59.44,28.44 v59.31,28.57
N$17
  Bottom 0.254: R14.1 R13.2 32.77,39.87 U3.3
N$18
  Top 0.508: Q1.3 55.69,25.4 D1.2
N$19
  Top 0.508: R15.P$1 51.12,24.93 D1.1
N$21
  Bottom 0.254: U12.1 10.54,34.81 R22.2
N$22
  Bottom 0.254: U12.16 11.13,34.12 R23.2
N$23
  Bottom 0.254: R24.2 10.71,32 12.45,33.74 U12.15
N$25
  Top 0.508: D2.2 22.26,50.05 R16.2
N$26
  Top 0.508: R17.2 17.78,56.03 D3.2
N$27
  Top 0.508: D4.2 23.5,61.75 R18.2
N$28
  Top 0.508: D5.2 28.57,56.36 R19.2
N$29
  Top 0.508: D6.2 24.77,61.75 R20.2
N$31
  Top 0.254: U11.24 19.14,49.51 R3.1
N$32
  Top 0.254: U11.18 17.76,45.88 R21.2
N$40
  Top 0.508: Q12.3 10.16,57.3 D12.-
N$41
  Top 0.508: D12.+ 7.3,54.18 R26.P$2
N$42
  Top 0.508: Q13.3 22.86,69.31 D13.-
N$43
  Top 0.508: D13.+ 20.12,68.58 R27.P$2
N$44
  Top 0.508: Q14.3 57.15,66.83 D14.-
N$45
  Top 0.508: D14.+ 53.2,69.85 R28.P$2
N$46
  Top 0.508: Q15.3 70.21,54.86 D15.-
N$47
  Top 0.508: D15.+ 68.07,56.2 R29.P$2
N$48
  Top 0.508: D16.- 67.12,19.97 Q20.3
N$49
  Top 0.508: D16.+ 70.8,24.59 R34.P$2
N$50
  Top 0.508: Q21.3 51.89,7.63 D17.-
N$51
  Top 0.508: D17.+ 57.62,10.48 R35.P$2
N$52
  Top 0.508: D18.- 20.13,9.56 Q22.3
N$53
  Top 0.508: R36.P$2 25.08,5.53 D18.+
N$54
  Top 0.508: D19.- 7.63,25.19 Q23.3
N$55
  Top 0.508: D19.+ 9.84,19.84 R37.P$2
N$56
  Bottom 0.254: U4.9 38.66,3.85 C55.2
N$57
  Bottom 0.254: R44.1 41.09,5.13 41.09,5.27 40.93,5.43 40.93,5.59 40.93,5.82 U4.4
N$58
  Bottom 0.254: U4.26 39.66,9.12 XTAL3.1 38.63,11.29 C56.2
N$59
  Bottom 0.254: U4.5 40.66,4.28 R42.2
N$60
  Bottom 0.254: U4.27 40.16,9.2 XTAL3.2 41.13,11.29 C57.2
N$61
  Bottom 0.254: U4.6 40.16,4.08 R45.2
N$62
  Bottom 0.254: U4.11 37.66,4.12 R43.1
N$63
  Bottom 0.254: U4.17 35.04,6.85 R46.2
N$64
  Bottom 0.254: U4.18 34.92,7.35 R47.2
N$65
  Top 0.965: U5.3 55.8,54.23 C59.P$2
  Top 1.27: C59.P$2 55.8,48.34 TP3.P1 57.47,46.67 Q28.2 | Q28.3 Q28.2 | Q28.1 Q28.2
  Bottom 1.27: R62.P$1 55.88,47.94 TP3.P1
N$66
  Top 0.254: R48.1 54.18,56.04 U5.1
N$67
  Top 0.254: R49.1 56.68,58.55 U5.5
N$68
  Top 0.254: R55.1 72.77,51.67 Q30.3
N$69
  Top 0.254: R55.2 72.77,49.64 74.28,51.15 74.28,52.13 Q30.2 74.9,52.75 70.97,52.75 69.76,51.54 67.76,51.54 66.39,50.16 Q29.1
  Top 1.27: Q28.10 59.98,49.09 Q28.9 | Q28.9 61.94,49.09 Q28.11 64.52,49.09 | Q28.9 59.05,51.98 Q28.8 Q28.5 62.87,51.98 Q28.9 | Q28.6 61.59,50.7 Q28.9 | Q28.7 60.33,50.7 Q28.9 | 64.52,49.09 65.53,49.09 Q29.2 | Q29.2 Q29.1 | Q29.2 Q29.3 65.61,47.74 R57.2 64.52,49.09
N$70
  Top 0.254: Q31.1 73.93,48.67 R56.1
N$71
  Top 0.254: R56.2 75.43,50.86 Q30.1
N$72
  Top 0.305: J2.4 61.16,62.08 R52.2
N$73
  Top 0.508: R53.2 J2.3
N$74
  Top 0.305: J2.2 62.08,61.16 R54.2
N$75
  Top 0.254: R57.1 64.63,46.35 Q29.4 67.1,44.98 71.35,44.98 72.36,45.99 Q31.3
N$76
  Bottom 0.254: Q32.4 65.09,50.8 Q33.3 61.59,50.8 61.21,51.18 61.21,52.58 62.29,53.66 R58.P$2
N$77
  Bottom 0.254: Q34.1 63.45,45.99 R59.P$1
N$78
  Bottom 0.254: R59.P$2 63.5,48.85 Q33.1
N$79
  Bottom 0.254: Q34.3 R60.P$2
N$80
  Bottom 0.813: U7.6 38.77,55.92 38.77,53.97 39.73,53 42.86,53 44.77,51.09 A1.1
N$82
  Top 0.254: R63.1 10.99,13.66 U6.4
N$83
  Bottom 0.254: R4.P$2 41.34,62.23 U7.4
N$84
  Bottom 0.813: U7.8 36.2,54.02 35.18,53 33.97,53 32.06,51.09 A1.6
N$85
  Bottom 0.254: R64.P$2 62.23,34.86 U8.4
N$86
  Bottom 0.813: U8.6 55.9,37.41 54.08,37.41 53,36.34 53,33.97 51.09,32.06 A2.1
N$87
  Bottom 0.813: U8.8 53.89,40.01 53,40.89 53,42.86 51.09,44.77 A2.6
N$88
  Bottom 0.254: R65.P$2 34.86,13.97 U9.4
N$89
  Bottom 0.813: U9.6 37.41,20.3 37.41,23.01 36.6,23.83 33.98,23.83 32.06,25.74 A3.1
N$90
  Bottom 0.813: U9.8 40.01,22.69 41.15,23.83 42.86,23.83 44.77,25.74 A3.6
N$91
  Bottom 0.254: U10.4 15.56,40.01 R66.P$2
N$92
  Bottom 0.813: U10.6 23.07,38.73 23.83,39.5 23.83,42.86 25.74,44.77 A4.1
N$93
  Bottom 0.813: U10.8 23.07,36.2 23.83,35.43 23.83,33.97 25.74,32.06 A4.6
N$104
  Bottom 1.27: R61.P$2 58.61,43.18 57.15,44.64 R62.P$2 56.94,44.77 52.07,49.64 J3.1 55.24,49.8 55.83,49.8 C61.P$2
N$999
  Top 0.254: C9.2 13.07,17.78 12.89,17.6 U6.1 | C9.2 | C9.2 C63.2 | C63.2 | C63.2 C8.2 13.39,20.52 13.51,20.62 FB2.1
PHOTO1  (via drill 0.2)
  Top 0.254: U1.9 14.56,17.8 14.46,17.7 14.4,17.7 v14.22,17.53
  Top 0.508: Q16.E 10.78,54.93 R30.P$2 12.83,54.8 TP9.P1
  Bottom 0.254: Q16.E 8.85,55.02 8.82,55 5.27,55 3.25,52.98 3.25,46.91 4.04,46.13 4.04,45.31 2.44,43.71 2.44,23.51 8.42,17.53 v14.22,17.53
PHOTO2  (via drill 0.2)
  Top 0.254: v14.22,16.76 14.4,16.94 14.46,16.94 14.82,17.3 U1.10
  Top 0.508: R31.P$2 24.89,68.3 Q17.E
  Bottom 0.254: Q17.E 23.28,68.14 22.54,68.14 21.02,69.67 19.36,69.67 2.85,53.15 2.85,46.75 3.63,45.96 3.63,45.48 2.03,43.88 2.03,23.34 8.61,16.76 v14.22,16.76
PHOTO3  (via drill 0.2)
  Top 0.254: v14.22,16 14.4,16.18 14.46,16.18 15.08,16.8 U1.11
  Top 0.508: R32.P$2 54.61,65.73 Q18.E
  Bottom 0.254: Q18.E 55.02,67.98 55,68.01 55,73.86 53.66,75.2 23.17,75.2 1.63,53.66 1.63,23.17 8.8,16 v14.22,16
PHOTO4  (via drill 0.2)
  Top 0.254: U1.12 14.55,15.24 v14.22,15.24
  Top 0.508: R33.P$2 66.35,52.82 Q19.E
  Bottom 0.254: Q19.E 66.42,53.81 65.64,53.81 64.43,55.03 64.43,57.68 59.69,62.42 59.69,69.75 53.83,75.61 23,75.61 1.22,53.83 1.22,23 8.98,15.24 v14.22,15.24
PHOTO5  (via drill 0.2)
  Top 0.254: v14.22,14.48 14.4,14.66 14.54,14.66 15.5,15.61 U1.13
  Top 0.508: Q24.E 65.92,21.59 R38.P$2
  Bottom 0.254: Q24.E 66.87,21.08 66.87,20.34 69.23,17.99 69.23,16.62 53.83,1.22 23,1.22 14.22,10 v14.22,14.48
PHOTO6  (via drill 0.2)
  Top 0.254: v14.86,13.84 15.03,13.84 15.2,14.01 15.57,14.01 16.8,15.24 U1.14
  Top 0.508: Q25.E 51.23,9.41 R39.P$2
  Bottom 0.254: Q25.E 52.82,7.58 52.8,7.55 52.8,2.74 51.69,1.63 23.17,1.63 14.86,9.94 v14.86,13.84
PHOTO7  (via drill 0.2)
  Top 0.254: v15.49,13.34 15.49,13.36 17.3,15.17 U1.15
  Top 0.508: R40.2 24.57,10.67 21.73,10.67 Q26.E
  Bottom 0.254: Q26.E 18.14,10.69 v15.49,13.34
PHOTO8  (via drill 0.2)
  Top 0.254: U1.8 15.6,18.29 v14.22,18.29
  Top 0.508: Q27.E 8.89,24.54 R41.P$2
  Bottom 0.254: Q27.E 10.41,23.02 11.19,23.02 14.81,19.39 14.81,18.81 14.46,18.47 14.4,18.47 v14.22,18.29
SCL  (via drill 0.2)
  Top 0.203: 18.7,44.61 18.85,44.76 18.85,45.91 18.86,45.92
  Top 0.254: R50.1 TP2.P1 | U11.19 18.88,46.58 18.88,46.07 18.86,46.05 18.86,45.92 | 18.7,44.61 15.11,41.02 v15.11,34.54 15.29,34.37 15.29,34.3 15.63,33.96 17.98,33.96 v22.99,28.96 | U1.32 26.02,19.8 v26.04,19.81
  Bottom 0.254: U4.19 32.17,8.42 TP2.P1 29.97,9.02 28.38,9.02 26.63,10.76 26.63,14.01 26.43,14.22 26.43,14.56 26.43,18 26.63,18.2 26.63,19.81 | U12.12 14.85,34.81 v15.11,34.54 | v22.99,28.96 22.99,28.89 26.63,25.25 26.63,19.81 | v26.04,19.81 26.63,19.81
SDA  (via drill 0.2)
  Top 0.203: 19.29,45.97 19.29,45.93 19.25,45.89 19.25,44.58
  Top 0.254: TP1.P1 R51.1 | U11.20 18.53,47.42 18.91,47.42 19.29,47.05 19.29,45.97 | 19.25,44.58 15.52,40.85 15.52,34.96 15.7,34.78 15.7,34.72 v15.88,34.54 18.22,34.54 23.57,29.2 23.57,29.14 v23.75,28.96 | U1.31 25.72,19.3 25.79,19.23 26.75,19.23 v27.69,18.29
  Bottom 0.254: U4.20 36.66,8.81 35.32,10.16 TP1.P1 29.97,11.56 28.38,11.56 27.04,12.89 27.04,14.18 26.84,14.38 26.84,17.83 27.04,18.03 27.04,18.29 | U12.13 14.71,34.12 14.87,33.96 15.35,33.96 15.7,34.3 15.7,34.37 v15.88,34.54 | v27.69,18.29 27.04,18.29 | v23.75,28.96 27.04,25.66 27.04,18.29
SWDCLK  (via drill 0.2)
  Top 0.254: v17.02,24.38 17.14,24.38 17.8,23.73 U1.45
  Bottom 0.254: R5.1 13.07,31.23 13.62,31.79 14.7,31.79 15.18,31.3 15.18,29.9 J1.P9 15.24,31.24 15.78,31.79 22.05,31.79 22.83,31.01 22.83,30.31 22.32,29.8 20.14,29.8 19.88,29.55 19.88,27.12 19.39,26.63 17.78,26.63 17.3,26.15 17.3,25.25 17.02,24.98 v17.02,24.38
SWDIO  (via drill 0.2)
  Top 0.254: v17.02,23.62 17.3,23.34 U1.46 | v12.32,32.51 13.97,30.86 J1.P10
  Bottom 0.254: v12.32,32.51 12.02,32.22 11.71,32.22 11.31,31.81 11.31,30.3 11.28,30.27 11.28,27.34 13.06,25.56 15.05,25.56 16.43,24.17 16.43,24.14 16.78,23.8 16.84,23.8 v17.02,23.62
VREFA
  Top 0.254: C79.2 14.72,20.57 | 14.72,20.57 FB2.2 | U1.4 15,20.3 14.72,20.57
XIN
  Top 0.254: U1.23 21.3,14.51 20.94,14.15 20.91,14.15 XTAL2.2 21.91,12.56 XTAL2.4 23.3,13.29 23.3,13.33 23.88,13.91 C14.2
XIN32
  Top 0.254: U1.1 15.61,22.34 13.97,23.98 XTAL1.1 13.7,24.76 C11.2
XOUT
  Top 0.254: C13.2 20.61,12.65 XTAL2.3 21.34,12.56 21.97,11.93 23.08,11.93 23.31,11.7 23.69,11.7 24.45,12.47 24.45,14.33 24.29,14.49 23.46,14.49 22.83,13.86 XTAL2.1 21.8,14.62 U1.24
XOUT32
  Top 0.254: U1.2 14.66,21.3 14.11,21.85 | 14.11,21.85 XTAL1.2 | C12.2 13.98,21.73 14.11,21.85